# Altium schematic sheet 10R Res.schdoc
size 127 x 99 mm
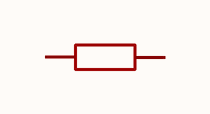
[diagram p0: 10R Res.schdoc]

## Parts
R?  10Ω  [R0603]  (value not drawn)

## Nets

Not connected (* = marked no-connect by the designer): R? 1 2

## Library data of the parts
R? = RS-03K100JT: Manufacturer: FH(风华); Add into BOM: yes; Tolerance: ±5%; Temperature Coefficient: ±100ppm/℃; Symbol: RS-03K100JT; Device: RS-03K100JT; LCSC Part Name: 厚膜电阻 10Ω ±5% 100mW; Supplier Part: C304686; Manufacturer Part: RS-03K100JT; Supplier Footprint: 0603; JLCPCB Part Class: Extended Part; Datasheet: https://atta.szlcsc.com/upload/public/pdf/source/20190505/C118335_36085569433BA7FFC796E569DBFE3139.pdf; Supplier: LCSC; Convert to PCB: yes; Type: Thick Film Resistors; Value: 10Ω; Operating Temperature Range: -55℃~+155℃